# EAGLE design I2C-Keypad-Backpack (EAGLE 9.5.2)
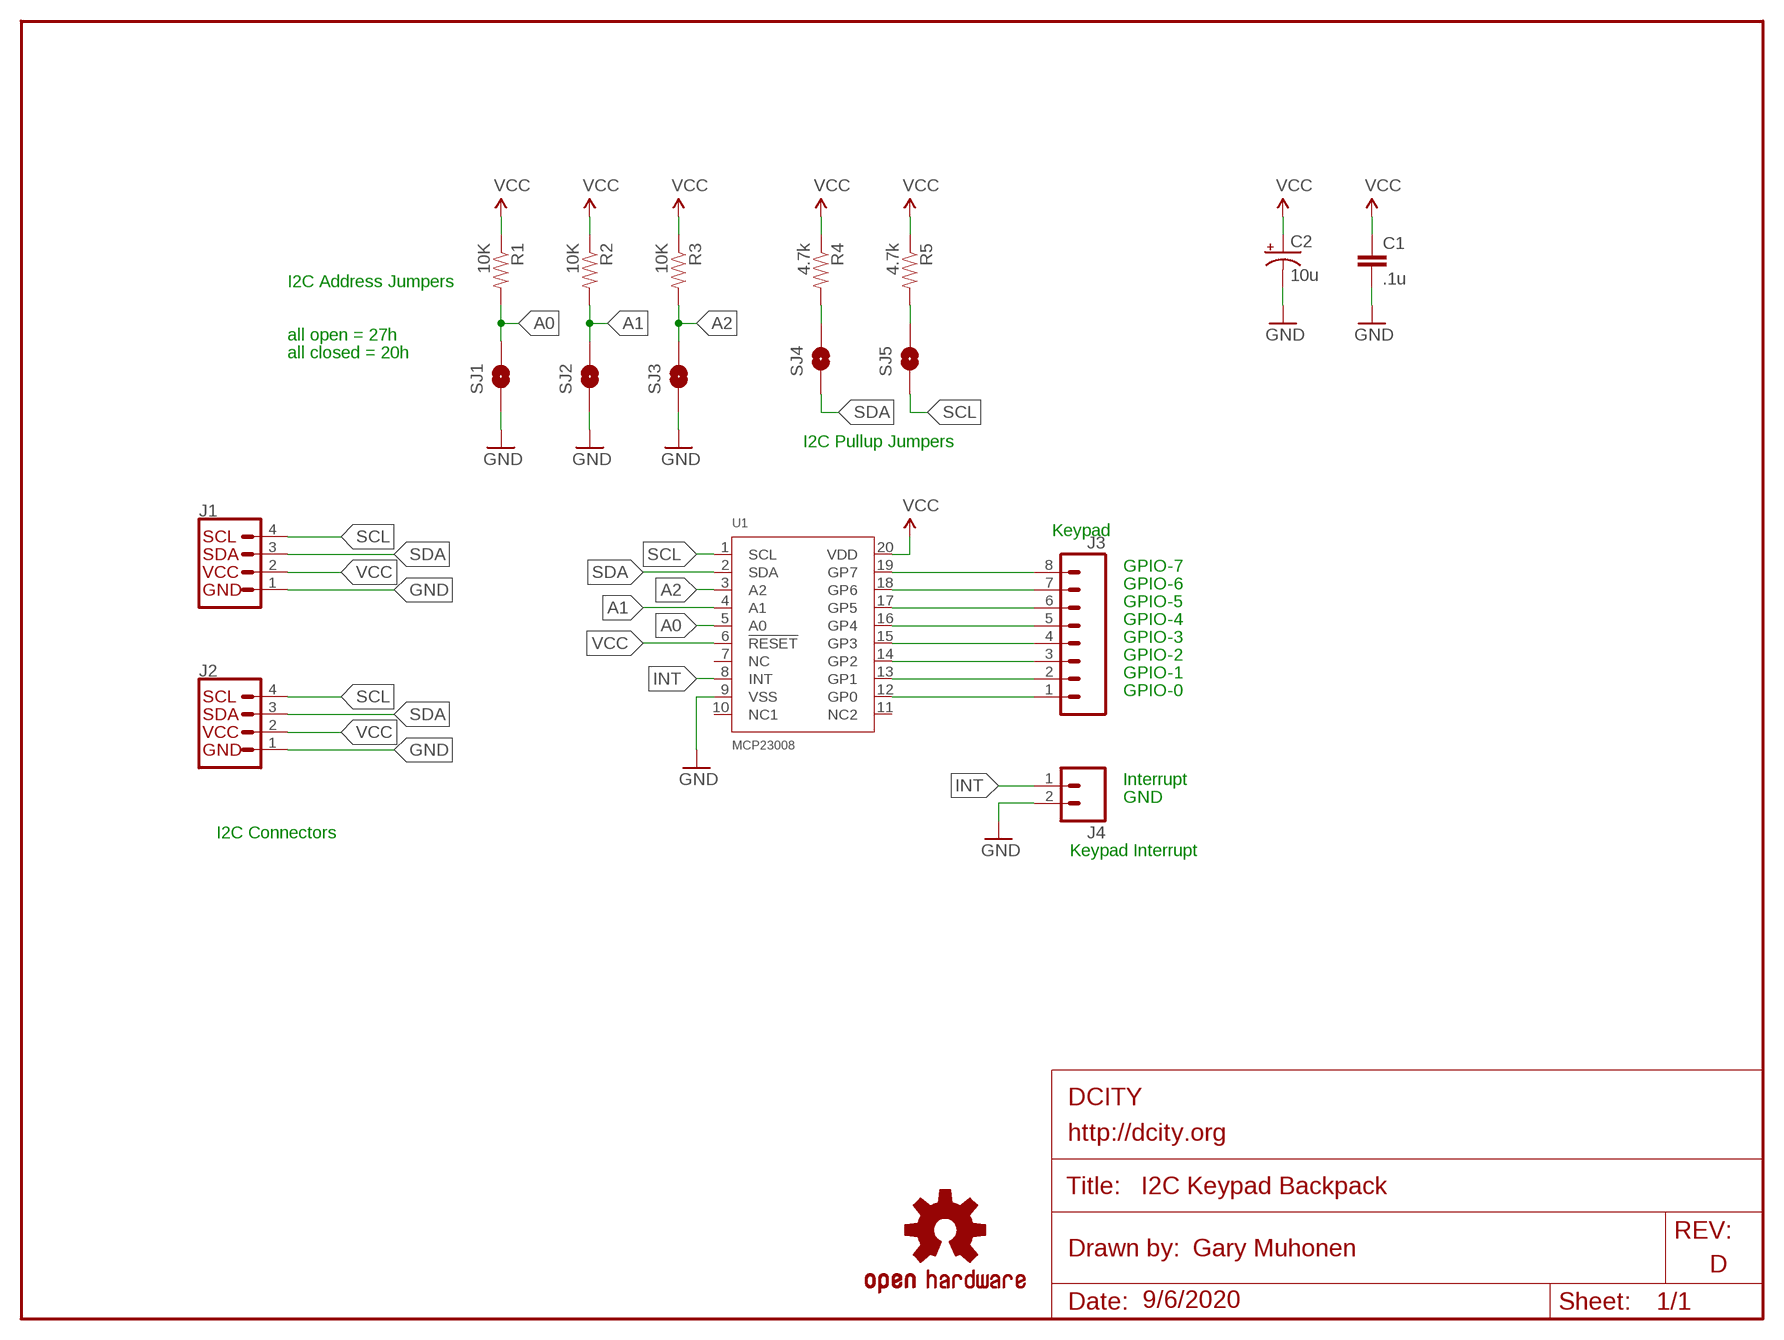
[diagram p0: schematic, sheet 1]
U$1 (DOCFIELD-WHT): COMPANYNAME: DCITY; COMPANYWEBSITE: http://dcity.org; DATE: 9/6/2020; DRAWNBY: Gary Muhonen; TITLE: I2C Keypad Backpack; VERSION: D

## Parts
C1  .1u  CAP0805  [0805-CAP]
C2  10u  CAP_POL0805  [0805-POL]
J1  QWIIC_RIGHT_ANGLE  QWIIC_CONNECTORJS-1MM  [JST04_1MM_RA]
J2  QWIIC_RIGHT_ANGLE  QWIIC_CONNECTORJS-1MM  [JST04_1MM_RA]
J3  M08LOCK  [1X08_LOCK]
J4  M02LOCK  [1X02_LOCK]
LOGO1  OSHW-LOGOS  [OSHW-LOGO-S]
R1  10K  RESISTOR0805  [0805-RES]
R2  10K  RESISTOR0805  [0805-RES]
R3  10K  RESISTOR0805  [0805-RES]
R4  4.7k  RESISTOR0805  [0805-RES]
R5  4.7k  RESISTOR0805  [0805-RES]
SJ1  SOLDERJUMPERNC  [SJ_2S]
SJ2  SOLDERJUMPERNC  [SJ_2S]
SJ3  SOLDERJUMPERNC  [SJ_2S]
SJ4  SOLDERJUMPERNC  [SJ_2S]
SJ5  SOLDERJUMPERNC  [SJ_2S]
U1  MCP23008  MCP23008-E/SS  [SSOP20-0.65-7.6X5.2MM]

## Nets
A0: R1.2 SJ1.2 U1.5(A0)
A1: R2.2 SJ2.2 U1.4(A1)
A2: R3.2 SJ3.2 U1.3(A2)
GND: C1.2 C2.- J1.1 J2.1 J4.2 SJ1.1 SJ2.1 SJ3.1 U1.9(VSS)
INT: J4.1 U1.8(INT)
N$1: R4.2 SJ4.2
N$2: R5.2 SJ5.2
N$3: J3.8 U1.19(GP7)
N$4: J3.7 U1.18(GP6)
N$5: J3.6 U1.17(GP5)
N$6: J3.5 U1.16(GP4)
N$7: J3.4 U1.15(GP3)
N$8: J3.3 U1.14(GP2)
N$9: J3.2 U1.13(GP1)
N$10: J3.1 U1.12(GP0)
SCL: J1.4 J2.4 SJ5.1 U1.1(SCL)
SDA: J1.3 J2.3 SJ4.1 U1.2(SDA)
VCC: C1.1 C2.+ J1.2 J2.2 R1.1 R2.1 R3.1 R4.1 R5.1 U1.6(!RESET) U1.20(VDD)
Unconnected: U1.7(NC) U1.10(NC1) U1.11(NC2)

## Notes on the sheet
- I2C Address Jumpers
- all open = 27h
- all closed = 20h
- I2C Pullup Jumpers
- Keypad
- GPIO-7
- GPIO-6
- GPIO-5
- GPIO-4
- GPIO-3
- GPIO-2
- GPIO-1
- GPIO-0
- Interrupt
- GND
- I2C Connectors
- Keypad Interrupt

## Library data of the parts
C1 = 0:CAP: Capacitor Standard 0603 ceramic capacitor, and 0.1" leaded capacitor.
C2 = 0:CAP_POL: Capacitor Polarized These are standard SMD and PTH capacitors. Normally 10uF, 47uF, and 100uF in electrolytic and tantalum varieties. Always verify the external diameter of the through hole cap, it varies with capacity, voltage, and manufacturer. The EIA devices should be standard.
J1 J2 = 0:QWIIC_CONNECTOR: SparkFun I2C Standard Qwiic Connector An SMD 1mm pitch JST connector makes it easy and quick (get it? Qwiic?) to connect I2C devices to each other. The Qwiic system <http://www.sparkfun.com/qwiic> enables fast and solderless connection between popular platforms and various sensors and actuators. We carry 200mm <https://www.sparkfun.com/products/14204>, 100mm <https://www.sparkfun.com/products/14205>, 50mm <https://www.sparkfun.com/products/14206>, and breadboard friendly <https://www.sparkfun.com/products/14207> Qwiic cables. We also offer 10 pcs strips <https://www.sparkfun.com/products/14323> the SMD connectors.; PROD_ID: CONN-13694
J3 = 0:M08: Header 8 Standard 8-pin 0.1" header. Use with straight break away headers (SKU : PRT-00116), right angle break away headers (PRT-00553), swiss pins (PRT-00743), machine pins (PRT-00117), and female headers (PRT-00115).
J4 = 0:M02: Header 2 Standard 2-pin 0.1" header. Use with straight break away headers (SKU : PRT-00116), right angle break away headers (PRT-00553), swiss pins (PRT-00743), machine pins (PRT-00117), and female headers (PRT-00115). Molex polarized connector foot print use with SKU : PRT-08233 with associated crimp pins and housings.
LOGO1 = 0:OSHW-LOGO: Open Source Hardware Logo This logo indicates the piece of hardware it is found on incorporates a OSHW license and/or adheres to the definition of open source hardware found here: http://freedomdefined.org/OSHW
R1-R5 = 0:RESISTOR: Resistor Basic schematic elements and footprints for 0603, 1206, and PTH 1/10th watt (small) resistors.
SJ1-SJ5 = 0:SOLDERJUMPER: Solder Jumper Standard SMD solder jumper. Used to automate production. Two varients : Normally Open and Normally Closed are the same, but have different paste layers. NC will have a large amount of paste and should jumper during reflow.
U1 = 0:MCP23008-E/SS: 310070051

## Board
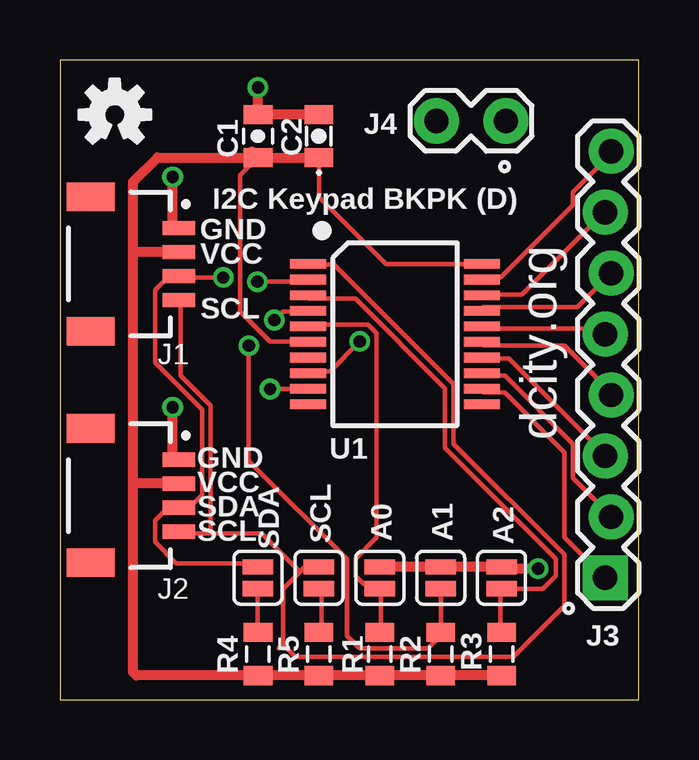
[diagram p1: board, top side]
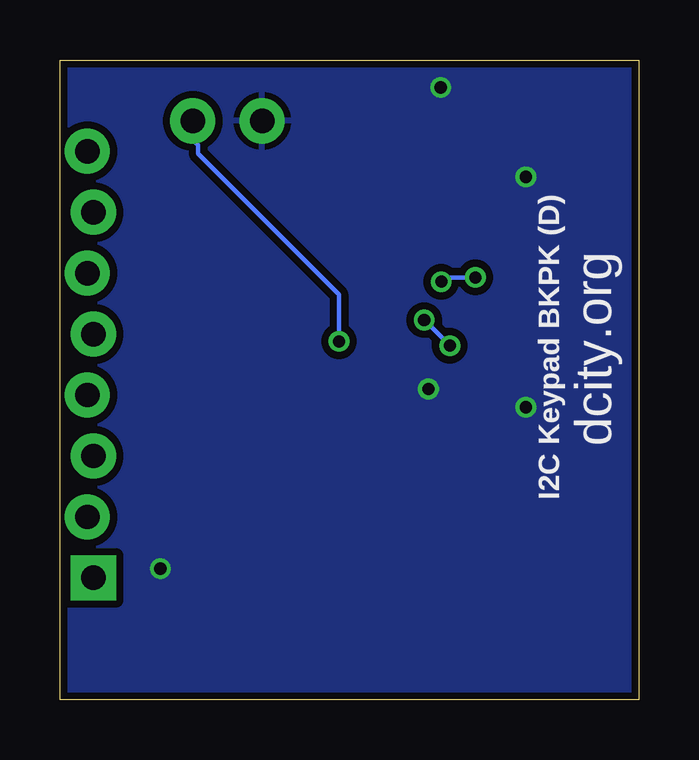
[diagram p2: board, bottom side, seen from below]

Size 24.13 x 26.67 mm. Coordinates in mm from the lower left corner, seen from the top.
Outline: 0,0 24.13,0 24.13,26.67 0,26.67 0,0
Copper layers (1*16): Top 0.035mm / dielectric 1.5mm / Bottom 0.035mm
Design rules "7mils-gary": minimum track width 7mil, minimum drill 20mil, track to track 7mil, track to pad 7mil, pad to pad 7mil, via to via 7mil, smd to smd 7mil, copper to edge 7mil, drill to drill 7mil, minimum pad ring 7mil, minimum via ring 7mil, stop-mask expansion 4mil, vias tented up to drill 25mil, thermal gap 10mil
vRestrict: area 18.2,21.8 to 18.9,22.6; area 7.7,6.3 to 8.9,8.9; area 10.3,6.5 to 11.4,8.9; area 12.8,6.5 to 14,8.3; area 15.5,6.5 to 16.6,8.1; area 18,6.3 to 19.2,8.1; area 6.3,22.5 to 7.6,24.3; area 9,22.5 to 10.2,24.1; area 9,1 to 10.2,2.8; area 11.6,0.9 to 12.7,2.7; area 14.1,0.8 to 15.2,2.7; area 16.6,1 to 17.8,2.8; 5 more areas

### Footprints (pad centres in the part's own frame; a part is rotated, then mirrored left to right if it is on the bottom)
0805-CAP = smd 0.8 x 1.2: 1 -0.9,0; 2 0.9,0
0805-POL = smd 0.8 x 1.2: + 0.9,0; - -0.9,0
JST04_1MM_RA = smd 0.6 x 1.35: 1 -1.5,0; 2 -0.5,0; 3 0.5,0; 4 1.5,0 | smd 1.2 x 2: NC1 2.8,-3.675; NC2 -2.8,-3.675
1X08_LOCK = drill 1.016 pad 1.88 square: 1 0,0.127 | drill 1.016 pad 1.88: 2 2.54,-0.127; 3 5.08,0.127; 4 7.62,-0.127; 5 10.16,0.127; 6 12.7,-0.127; 7 15.24,0.127; 8 17.78,-0.127
1X02_LOCK = drill 1.016 pad 1.88: 1 -0.178,0; 2 2.718,0
0805-RES = smd 0.8 x 1.2: 1 -0.9,0; 2 0.9,0
SJ_2S = smd 0.635 x 1.27: 1 -0.45,0; 2 0.45,0
SSOP20-0.65-7.6X5.2MM = smd 0.4 x 1.5: 1 -2.925,-3.625; 2 -2.275,-3.625; 3 -1.625,-3.625; 4 -0.975,-3.625; 5 -0.325,-3.625; 6 0.325,-3.625; 7 0.975,-3.625; 8 1.625,-3.625; 9 2.275,-3.625; 10 2.925,-3.625; 11 2.925,3.625; 12 2.275,3.625; 13 1.625,3.625; 14 0.975,3.625; 15 0.325,3.625; 16 -0.325,3.625; 17 -0.975,3.625; 18 -1.625,3.625; 19 -2.275,3.625; 20 -2.925,3.625

### Placement (x,y rotation side)
C1  8.26,23.5 90 top
C2  10.79,23.5 270 top
J1  4.95,18.16 270 top
J2  4.95,8.51 270 top
J3  22.86,5.08 90 top
J4  18.41,24.13 180 top
LOGO1  2.29,24.38 0 top
R1  13.34,1.91 90 top
R2  15.88,1.91 90 top
R3  18.41,1.91 90 top
R4  8.26,1.91 90 top
R5  10.79,1.91 90 top
SJ1  13.34,5.08 270 top
SJ2  15.88,5.08 270 top
SJ3  18.41,5.08 270 top
SJ4  8.26,5.08 270 top
SJ5  10.79,5.08 270 top
U1  13.97,15.24 270 top

### Tracks (layer width: path | path; a pad name or v marks a point on that pad's centre or on a via)
A0
  Top 0.178: R1.2 13.39,2.85 13.39,4.62 SJ1.2 13.21,4.8 12.68,4.8 12.32,5.16 12.32,5.87 13.21,6.76 13.21,15.29 12.85,15.65 10.36,15.65 U1.5
A1  (via drill 0.51)
  Top 0.178: SJ2.2 R2.2 15.88,2.67 15.34,2.13 12.5,2.13 11.96,2.67 11.96,5.87 7.87,9.96 v7.87,14.76 | v8.94,15.82 9.3,16.18 10.19,16.18 U1.4
  Bottom 0.178: v7.87,14.76 v8.94,15.82
A2
  Top 0.178: R3.2 18.36,2.85 18.36,4.62 SJ3.2 18.54,4.62 20.14,4.62 20.68,5.16 20.68,5.87 16.05,10.49 16.05,12.98 12.32,16.71 10.36,16.71 U1.3
GND  (via drill 0.51)
  Top 0.178: v8.76,12.95 10.33,12.95 U1.9 | 15.88,5.51 SJ2.1
  Top 0.406: v19.94,5.46 18.48,5.46 SJ3.1 SJ2.1 SJ1.1 | C2.- C1.2 v8.26,25.53 | J2.1 4.7,10.26 v4.7,12.19 | J1.1 4.7,19.91 v4.7,21.79 4.7,21.84
  pour Bottom (isolate 0.305): 0,26.67 24.13,26.67 24.13,0 0,0
INT  (via drill 0.51)
  Top 0.178: v12.5,14.94 11.25,13.69 10.36,13.69 U1.8
  Bottom 0.178: v12.5,14.94 12.5,16.89 18.36,22.76 18.36,23.11 18.54,23.29 18.54,24 J4.1
N$1
  Top 0.178: R4.2 8.23,2.85 8.23,4.62 SJ4.2
N$2
  Top 0.178: R5.2 10.9,2.85 10.9,4.62 SJ5.2
N$3
  Top 0.178: U1.19 17.65,17.6 18.36,17.6 21.39,20.62 21.39,21.16 22.99,22.76 J3.8
N$4
  Top 0.178: U1.18 17.65,16.89 19.25,16.89 22.63,20.27 J3.7
N$5
  Top 0.178: J3.6 21.57,16.36 17.65,16.36 U1.17
N$6
  Top 0.178: U1.16 17.65,15.47 22.45,15.47 22.63,15.29 J3.5
N$7
  Top 0.178: U1.15 17.65,14.76 21.03,14.76 22.99,12.8 J3.4
N$8
  Top 0.178: U1.14 17.65,14.22 18.72,14.22 22.63,10.31 J3.3
N$9
  Top 0.178: U1.13 17.65,13.51 18.54,13.51 21.39,10.67 21.39,9.25 22.99,7.64 J3.2
N$10
  Top 0.178: U1.12 17.65,12.8 18.54,12.8 21.03,10.31 21.03,6.76 22.63,5.16 J3.1
SCL
  Top 0.178: 10.19,5.51 10.72,5.51 SJ5.1 10.19,5.51 | 10.01,5.33 9.3,4.62 9.3,2.31 | 10.01,5.33 10.19,5.51 | 9.12,2.13 9.3,2.31 | 9.3,2.31 9.83,1.78 18.9,1.78 21.03,3.91 21.03,6.04 16.41,10.67 16.41,13.16 11.43,18.14 10.36,18.14 U1.1 | 6.27,6.93 8.41,6.93 10.01,5.33 | 6.27,6.93 5.03,6.93 J2.4 | 6.27,6.93 6.27,12.27 5.03,13.51 5.03,16.54 J1.4
SDA  (via drill 0.51)
  Top 0.178: 8.23,5.51 SJ4.1 8.23,5.69 4.85,5.69 3.96,6.58 3.96,7.47 4.5,8 4.85,8 J2.3 5.03,8.18 5.56,8.18 5.92,8.53 5.92,12.09 3.96,14.05 3.96,17.07 4.5,17.6 4.85,17.6 J1.3 5.03,17.6 v6.81,17.6 | 10.19,17.6 U1.2 10.19,17.42 v8.23,17.42
  Bottom 0.178: v8.23,17.42 8.05,17.6 v6.81,17.6
VCC
  Top 0.178: U1.20 13.59,18.16 10.79,20.95 C2.+ | U1.6 10.19,14.94 8.76,14.94 7.52,16.18 7.52,20.32 7.52,20.62 7.52,21.86 C1.1
  Top 0.406: R3.1 R2.1 R1.1 R5.1 R4.1 3.19,1 3.05,1.14 3.05,8.89 | C1.1 C2.+ | 7.99,22.86 C1.1 | 3.05,8.89 3.05,18.54 | 3.05,18.54 3.05,21.59 4.06,22.61 8.24,22.61 C1.1 | J1.2 3.17,18.66 3.05,18.54 | J2.2 3.17,9.01 3.05,8.89

### Text on the board
tPlace: I2C Keypad BKPK (D) | GND | dcity.org | VCC | SCL | GND | VCC | SDA | SCL | SDA | SCL | A0 | A1 | A2
bPlace: I2C Keypad BKPK (D) | dcity.org